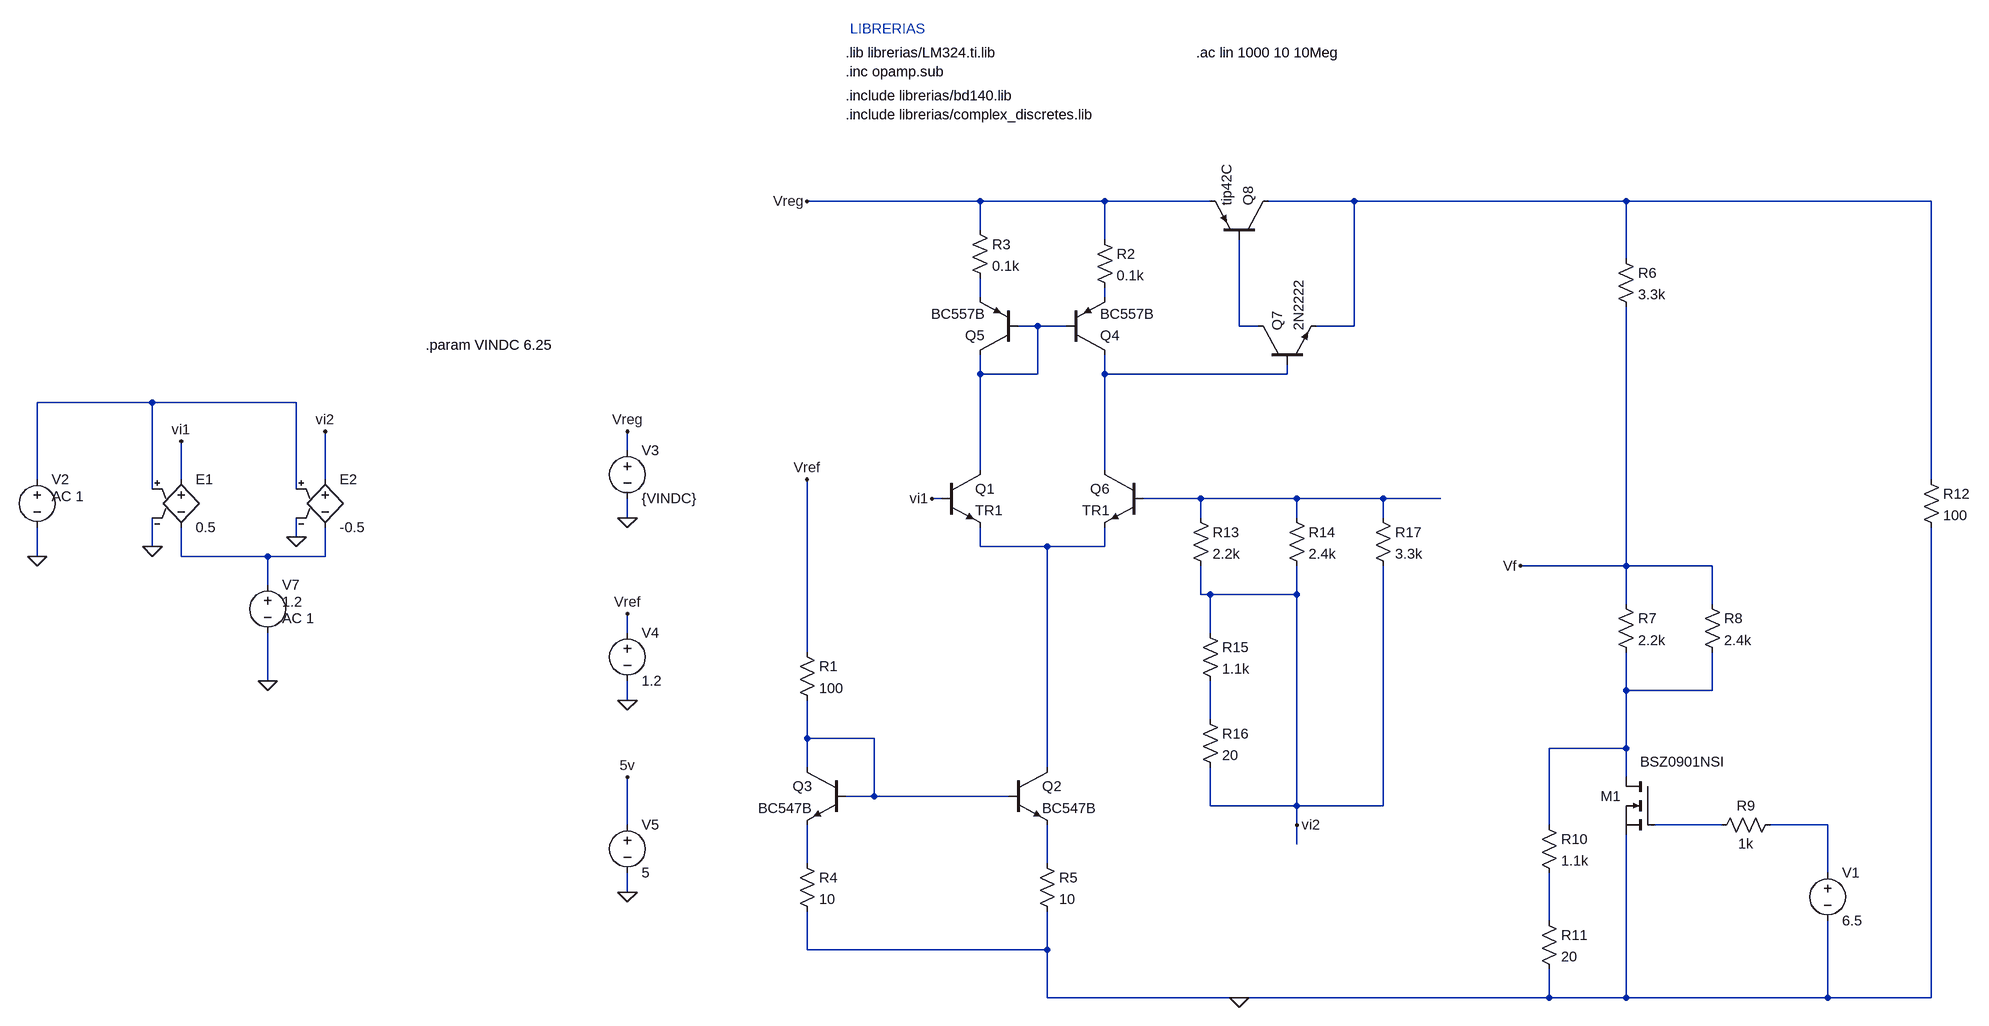
[diagram p0: schematic gancia_a.asc]
gancia_a.asc, the LTspice schematic file:
Version 4
SHEET 1 1028 680
WIRE -704 -1024 -992 -1024
WIRE -496 -1024 -704 -1024
WIRE -320 -1024 -496 -1024
WIRE -80 -1024 -224 -1024
WIRE 416 -1024 -80 -1024
WIRE 960 -1024 416 -1024
WIRE -704 -976 -704 -1024
WIRE -496 -960 -496 -1024
WIRE 416 -928 416 -1024
WIRE -704 -864 -704 -896
WIRE -496 -864 -496 -880
WIRE -608 -816 -640 -816
WIRE -560 -816 -608 -816
WIRE -272 -816 -272 -960
WIRE -240 -816 -272 -816
WIRE -80 -816 -80 -1024
WIRE -80 -816 -144 -816
WIRE -704 -736 -704 -768
WIRE -608 -736 -608 -816
WIRE -608 -736 -704 -736
WIRE -496 -736 -496 -768
WIRE -192 -736 -192 -752
WIRE -192 -736 -496 -736
WIRE -2160 -688 -2352 -688
WIRE -1920 -688 -2160 -688
WIRE -1360 -608 -1360 -640
WIRE -704 -576 -704 -736
WIRE -496 -576 -496 -736
WIRE -2352 -560 -2352 -688
WIRE -2112 -560 -2112 -624
WIRE -1872 -560 -1872 -640
WIRE 960 -560 960 -1024
WIRE -2160 -544 -2160 -688
WIRE -1920 -544 -1920 -688
WIRE -768 -528 -784 -528
WIRE -336 -528 -432 -528
WIRE -176 -528 -336 -528
WIRE -32 -528 -176 -528
WIRE 64 -528 -32 -528
WIRE -1360 -496 -1360 -528
WIRE -336 -496 -336 -528
WIRE -176 -496 -176 -528
WIRE -32 -496 -32 -528
WIRE -1920 -464 -1920 -496
WIRE -2160 -448 -2160 -496
WIRE -704 -448 -704 -480
WIRE -592 -448 -704 -448
WIRE -496 -448 -496 -480
WIRE -496 -448 -592 -448
WIRE -2352 -432 -2352 -480
WIRE -2112 -432 -2112 -480
WIRE -1968 -432 -2112 -432
WIRE -1872 -432 -1872 -480
WIRE -1872 -432 -1968 -432
WIRE 416 -416 416 -848
WIRE 416 -416 240 -416
WIRE 560 -416 416 -416
WIRE -1968 -384 -1968 -432
WIRE -336 -368 -336 -416
WIRE -320 -368 -336 -368
WIRE -176 -368 -176 -416
WIRE -176 -368 -320 -368
WIRE 416 -352 416 -416
WIRE 560 -352 560 -416
WIRE -1360 -304 -1360 -336
WIRE -320 -304 -320 -368
WIRE -992 -272 -992 -560
WIRE -1968 -224 -1968 -304
WIRE 416 -208 416 -272
WIRE 560 -208 560 -272
WIRE 560 -208 416 -208
WIRE -1360 -192 -1360 -224
WIRE -320 -160 -320 -224
WIRE -992 -128 -992 -192
WIRE -880 -128 -992 -128
WIRE 416 -112 416 -208
WIRE 416 -112 288 -112
WIRE -992 -80 -992 -128
WIRE -592 -80 -592 -448
WIRE 416 -64 416 -112
WIRE -880 -32 -880 -128
WIRE -880 -32 -928 -32
WIRE -656 -32 -880 -32
WIRE -320 -16 -320 -80
WIRE -176 -16 -176 -368
WIRE -176 -16 -320 -16
WIRE -32 -16 -32 -416
WIRE -32 -16 -176 -16
WIRE -1360 16 -1360 -64
WIRE -176 16 -176 -16
WIRE 288 16 288 -112
WIRE 576 16 464 16
WIRE 752 16 656 16
WIRE -176 48 -176 16
WIRE -992 80 -992 16
WIRE -592 80 -592 16
WIRE 752 96 752 16
WIRE -1360 128 -1360 96
WIRE 288 176 288 96
WIRE -992 224 -992 160
WIRE -592 224 -592 160
WIRE -592 224 -992 224
WIRE -592 304 -592 224
WIRE -272 304 -592 304
WIRE 288 304 288 256
WIRE 288 304 -272 304
WIRE 416 304 416 32
WIRE 416 304 288 304
WIRE 752 304 752 176
WIRE 752 304 416 304
WIRE 960 304 960 -480
WIRE 960 304 752 304
FLAG 240 -416 Vf
FLAG -272 304 0
FLAG -1360 -496 0
FLAG -1360 -192 0
FLAG -1360 -640 Vreg
FLAG -1360 -336 Vref
FLAG -1360 128 0
FLAG -1360 -64 5v
FLAG -992 -1024 Vreg
FLAG -1968 -224 0
FLAG -2112 -624 vi1
FLAG -1872 -640 vi2
FLAG -784 -528 vi1
FLAG -176 16 vi2
FLAG -1920 -464 0
FLAG -2160 -448 0
FLAG -2352 -432 0
FLAG -992 -560 Vref
DATAFLAG -784 -528 ""
DATAFLAG -496 -704 ""
DATAFLAG -704 -656 ""
SYMBOL npn -768 -576 R0
SYMATTR InstName Q1
SYMATTR Value TR1
SYMBOL npn -656 -80 R0
SYMATTR InstName Q2
SYMATTR Value BC547B
SYMBOL npn -928 -80 M0
SYMATTR InstName Q3
SYMATTR Value BC547B
SYMBOL res -1008 -288 R0
SYMATTR InstName R1
SYMATTR Value 100
SYMBOL res -512 -976 R0
SYMATTR InstName R2
SYMATTR Value 0.1k
SYMBOL res -720 -992 R0
SYMATTR InstName R3
SYMATTR Value 0.1k
SYMBOL pnp -560 -768 M180
SYMATTR InstName Q4
SYMATTR Value BC557B
SYMBOL pnp -640 -768 R180
SYMATTR InstName Q5
SYMATTR Value BC557B
SYMBOL npn -432 -576 M0
SYMATTR InstName Q6
SYMATTR Value TR1
SYMBOL res -1008 64 R0
SYMATTR InstName R4
SYMATTR Value 10
SYMBOL res -608 64 R0
SYMATTR InstName R5
SYMATTR Value 10
SYMBOL res 400 -944 R0
SYMATTR InstName R6
SYMATTR Value 3.3k
SYMBOL res 400 -368 R0
SYMATTR InstName R7
SYMATTR Value 2.2k
SYMBOL res 544 -368 R0
SYMATTR InstName R8
SYMATTR Value 2.4k
SYMBOL nmos 464 -64 M0
WINDOW 3 -116 -25 Left 2
SYMATTR Value BSZ0901NSI
SYMATTR InstName M1
SYMBOL res 672 0 R90
WINDOW 0 0 56 VBottom 2
WINDOW 3 32 56 VTop 2
SYMATTR InstName R9
SYMATTR Value 1k
SYMBOL voltage 752 80 R0
WINDOW 123 0 0 Left 0
WINDOW 39 0 0 Left 0
SYMATTR InstName V1
SYMATTR Value 6.5
SYMBOL res 272 0 R0
SYMATTR InstName R10
SYMATTR Value 1.1k
SYMBOL res 272 160 R0
SYMATTR InstName R11
SYMATTR Value 20
SYMBOL npn -240 -752 R270
SYMATTR InstName Q7
SYMATTR Value 2N2222
SYMBOL pnp -224 -960 M270
SYMATTR InstName Q8
SYMATTR Value tip42C
SYMBOL res 944 -576 R0
SYMATTR InstName R12
SYMATTR Value 100
SYMBOL voltage -1360 -624 R0
WINDOW 123 0 0 Left 0
WINDOW 39 0 0 Left 0
SYMATTR InstName V3
SYMATTR Value {VINDC}
SYMBOL voltage -1360 -320 R0
WINDOW 123 0 0 Left 0
WINDOW 39 0 0 Left 0
SYMATTR InstName V4
SYMATTR Value 1.2
SYMBOL voltage -1360 0 R0
WINDOW 123 0 0 Left 0
WINDOW 39 0 0 Left 0
SYMATTR InstName V5
SYMATTR Value 5
SYMBOL res -352 -512 R0
SYMATTR InstName R13
SYMATTR Value 2.2k
SYMBOL res -192 -512 R0
SYMATTR InstName R14
SYMATTR Value 2.4k
SYMBOL res -336 -320 R0
SYMATTR InstName R15
SYMATTR Value 1.1k
SYMBOL res -336 -176 R0
SYMATTR InstName R16
SYMATTR Value 20
SYMBOL res -48 -512 R0
SYMATTR InstName R17
SYMATTR Value 3.3k
SYMBOL voltage -1968 -400 R0
WINDOW 3 24 44 Left 2
WINDOW 123 24 72 Left 2
WINDOW 39 0 0 Left 0
SYMATTR Value 1.2
SYMATTR Value2 AC 1
SYMATTR InstName V7
SYMBOL e -2112 -576 R0
SYMATTR InstName E1
SYMATTR Value 0.5
SYMBOL e -1872 -576 R0
SYMATTR InstName E2
SYMATTR Value -0.5
SYMBOL voltage -2352 -576 R0
WINDOW 123 24 44 Left 2
WINDOW 39 0 0 Left 0
SYMATTR Value2 AC 1
SYMATTR InstName V2
SYMATTR Value ""
TEXT -928 -1200 Left 2 !.include librerias/bd140.lib
TEXT -928 -1240 Left 2 !.inc opamp.sub
TEXT -928 -1272 Left 2 !.lib librerias/LM324.ti.lib
TEXT -920 -1312 Left 2 ;LIBRERIAS
TEXT -928 -1168 Left 2 !.include librerias/complex_discretes.lib
TEXT -344 -1272 Left 2 !.ac lin 1000 10 10Meg
TEXT -1696 -784 Left 2 !.param VINDC 6.25

The netlist it stands for:
* gancia_a.asc
Q1 N004 vi1 N009 0 TR1
Q2 N009 N013 N017 0 BC547B
Q3 N013 N013 N016 0 BC547B
R1 Vref N013 100
R2 Vreg N003 0.1k
R3 Vreg N002 0.1k
Q4 N006 N004 N003 0 BC557B
Q5 N004 N004 N002 0 BC557B
Q6 N006 N008 N009 0 TR1
R4 N016 0 10
R5 N017 0 10
R6 N001 Vf 3.3k
R7 Vf N011 2.2k
R8 Vf N011 2.4k
M1 N011 N014 0 0 BSZ0901NSI
R9 N015 N014 1k
V1 N015 0 6.5
R10 N011 N018 1.1k
R11 N018 0 20
Q7 N005 N006 N001 0 2N2222
Q8 N001 N005 Vreg 0 tip42C
R12 N001 0 100
V3 Vreg 0 {VINDC}
V4 Vref 0 1.2
V5 5v 0 5
R13 N008 vi2 2.2k
R14 N008 vi2 2.4k
R15 vi2 N012 1.1k
R16 N012 vi2 20
R17 N008 vi2 3.3k
V7 N010 0 1.2 AC 1
E1 vi1 N010 N007 0 0.5
E2 vi2 N010 N007 0 -0.5
V2 N007 0 AC 1
.model NPN NPN
.model PNP PNP
.lib standard.bjt
.model NMOS NMOS
.model PMOS PMOS
.lib standard.mos
.include librerias/bd140.lib
.inc opamp.sub
.lib librerias/LM324.ti.lib
* LIBRERIAS
.include librerias/complex_discretes.lib
.ac lin 1000 10 10Meg
.param VINDC 6.25
.backanno
.end